# EAGLE design LineFollowTest (EAGLE 9.4.2)

## Sheet 1 of 3
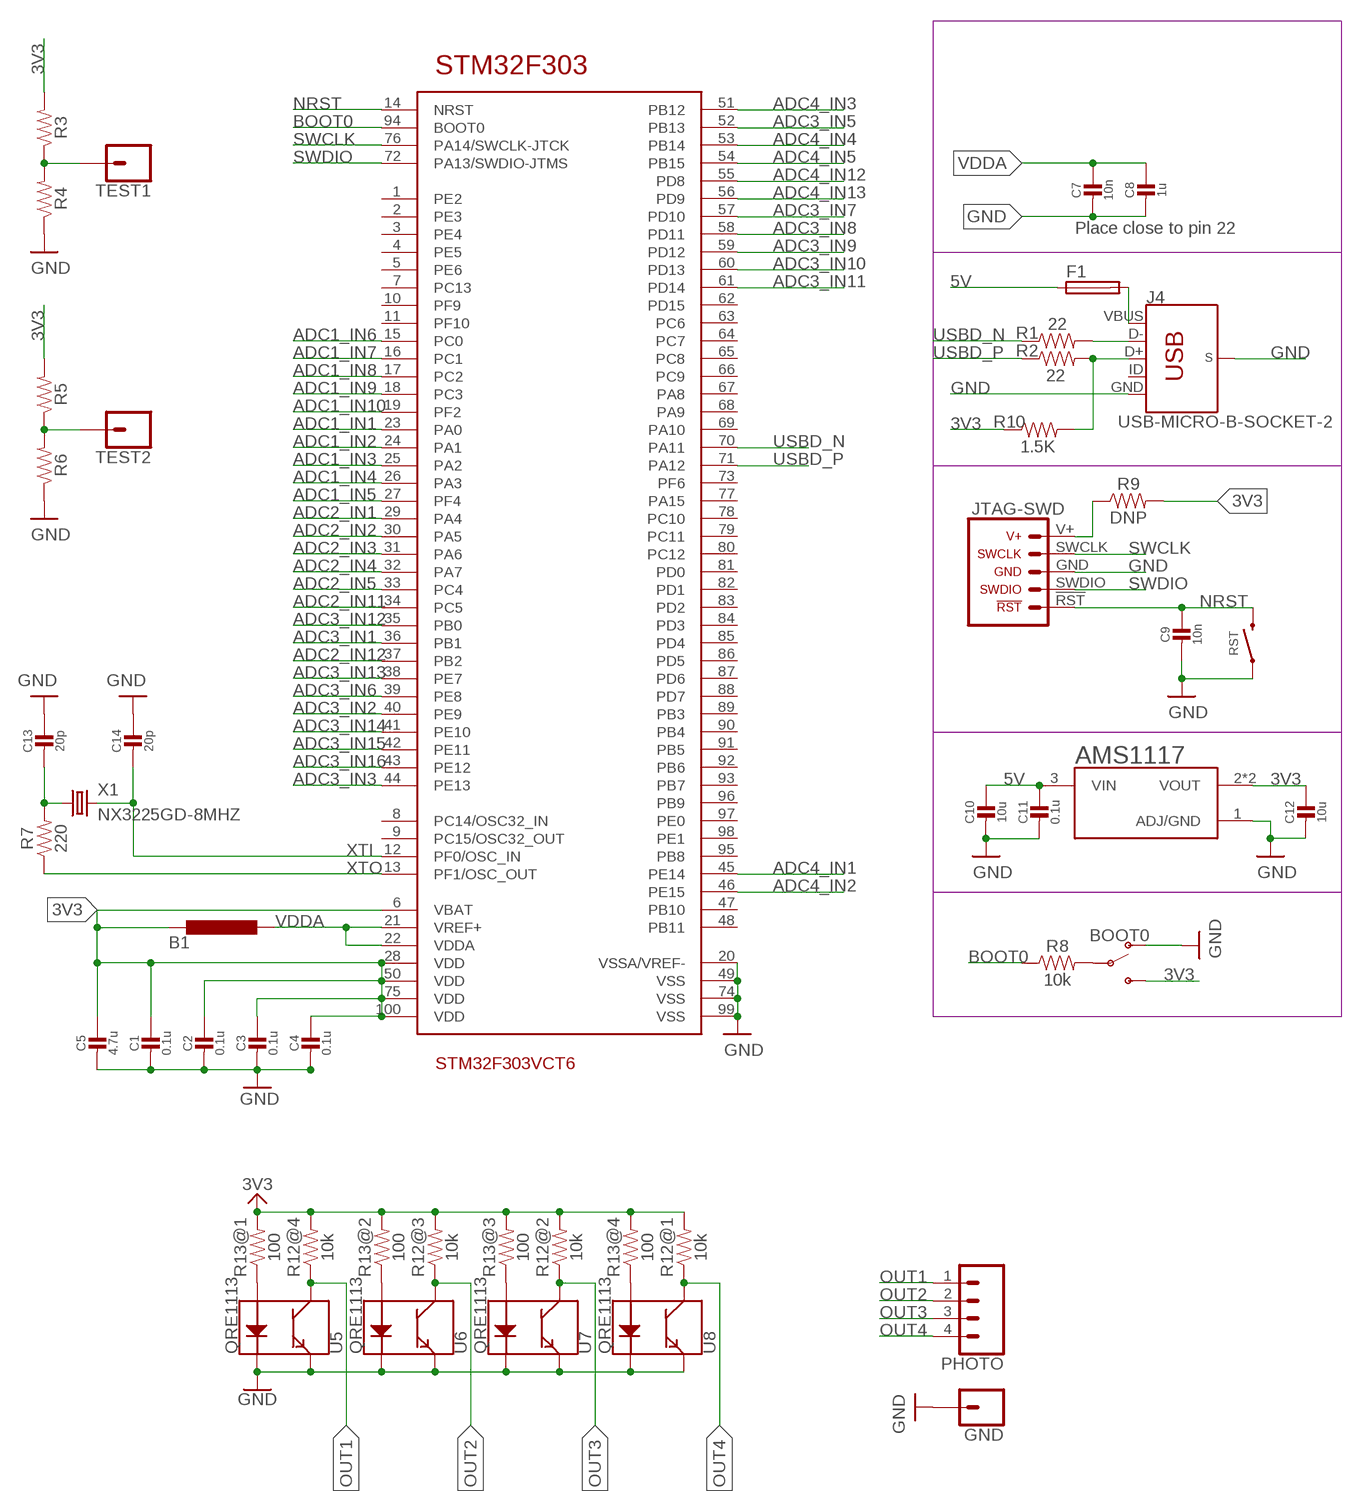
[diagram p0: schematic, sheet 1]

### Parts
AMS1117  3.3V  VREG_AMS1117SMALL  [SOT89]
B1  BEAD-0603  [0603]
BOOT0  SWITCH_SPDT_SLIDE  [SWITCH_SPDT_PTH_11.6X4.0MM]
C1  0.1u  CAP_CERAMIC_0603  [CAP_0603]
C2  0.1u  CAP_CERAMIC_0603  [CAP_0603]
C3  0.1u  CAP_CERAMIC_0603  [CAP_0603]
C4  0.1u  CAP_CERAMIC_0603  [CAP_0603]
C5  4.7u  CAP_CERAMIC_0603  [CAP_0603]
C7  10n  CAP_CERAMIC_0603  [CAP_0603]
C8  1u  CAP_CERAMIC_0603  [CAP_0603]
C9  10n  CAP_CERAMIC_0603  [CAP_0603]
C10  10u  CAP_CERAMIC_0603  [CAP_0603]
C11  0.1u  CAP_CERAMIC_0603  [CAP_0603]
C12  10u  CAP_CERAMIC_0603  [CAP_0603]
C13  20p  CAP_CERAMIC_0603  [CAP_0603]
C14  20p  CAP_CERAMIC_0603  [CAP_0603]
F1  FUSE-1206  [1206]
GND  THD_01  [1X01]
J4  USB-MICRO-B-SOCKET-2  [USB-MICRO-B-SOCKET-2]
PHOTO  CONN_04PTH  [1X04]
R1  22  RESISTOR0603  [0603]
R2  22  RESISTOR0603  [0603]
R3  RESISTOR0603  [0603]
R4  RESISTOR0603  [0603]
R5  RESISTOR0603  [0603]
R6  RESISTOR0603  [0603]
R7  220  RESISTOR0603  [0603]
R8  10k  RESISTOR0603  [0603]
R9  DNP  RESISTOR0603  [0603]
R10  1.5K  RESISTOR0603  [0603]
R12  10k  RESISTOR_ARRAY_1206_SEPARATE  [RESCAF80P320X160X60-8N]
R13  100  RESISTOR_ARRAY_1206_SEPARATE  [RESCAF80P320X160X60-8N]
RST  PUSHBUTTON  [TACTILE_SWITCH_SMD_6.0X3.5MM]
STM32F303  STM32F303VCT6  [LQFP-100]
TEST1  THD_01  [1X01]
TEST2  THD_01  [1X01]
U5  QRE1113  QRE1113SMD-W  [QRE1113-W]
U6  QRE1113  QRE1113SMD-W  [QRE1113-W]
U7  QRE1113  QRE1113SMD-W  [QRE1113-W]
U8  QRE1113  QRE1113SMD-W  [QRE1113-W]
U$3  JTAG-SWD  [JTAG_SWD]
X1  NX3225GD-8MHZ  XTAL-SMD-3225  [XTAL-SMD-3225]

### Nets
3V3: AMS1117.2(VOUT) AMS1117.2@1(VOUT) B1.1 BOOT0.3(S) C1.1 C2.1 C3.1 C4.1 C5.1 C12.1 R3.2 R5.2 R9.2 R10.1 R12.5 R12.6 R12.7 R12.8 R13.5 R13.6 R13.7 R13.8 STM32F303.6(VBAT) STM32F303.28(VDD) STM32F303.50(VDD) STM32F303.75(VDD) STM32F303.100(VDD) ; supply symbol labelled SUPPLY_3.3V
5V: AMS1117.3(VIN) C10.1 C11.1 F1.1
ADC1_IN1: STM32F303.23(PA0) ; also sheet 2
ADC1_IN2: STM32F303.24(PA1) ; also sheet 2
ADC1_IN3: STM32F303.25(PA2) ; also sheet 2
ADC1_IN4: STM32F303.26(PA3) ; also sheet 2
ADC1_IN5: STM32F303.27(PF4) ; also sheet 2
ADC1_IN6: STM32F303.15(PC0) ; also sheet 2
ADC1_IN7: STM32F303.16(PC1) ; also sheet 2
ADC1_IN8: STM32F303.17(PC2) ; also sheet 2
ADC1_IN9: STM32F303.18(PC3) ; also sheet 2
ADC1_IN10: STM32F303.19(PF2) ; also sheet 2
ADC2_IN1: STM32F303.29(PA4) ; also sheet 2
ADC2_IN2: STM32F303.30(PA5) ; also sheet 2
ADC2_IN3: STM32F303.31(PA6) ; also sheet 2
ADC2_IN4: STM32F303.32(PA7) ; also sheet 2
ADC2_IN5: STM32F303.33(PC4) ; also sheet 2
ADC2_IN11: STM32F303.34(PC5) ; also sheet 2
ADC2_IN12: STM32F303.37(PB2) ; also sheet 2
ADC3_IN1: STM32F303.36(PB1) ; also sheet 2
ADC3_IN2: STM32F303.40(PE9) ; also sheet 2
ADC3_IN3: STM32F303.44(PE13) ; also sheet 2
ADC3_IN5: STM32F303.52(PB13) ; also sheet 2
ADC3_IN6: STM32F303.39(PE8) ; also sheet 2
ADC3_IN7: STM32F303.57(PD10) ; also sheet 2
ADC3_IN8: STM32F303.58(PD11) ; also sheet 2
ADC3_IN9: STM32F303.59(PD12) ; also sheet 2
ADC3_IN10: STM32F303.60(PD13) ; also sheet 2
ADC3_IN11: STM32F303.61(PD14) ; also sheet 2
ADC3_IN12: STM32F303.35(PB0) ; also sheet 2
ADC3_IN13: STM32F303.38(PE7) ; also sheet 2
ADC3_IN14: STM32F303.41(PE10) ; also sheet 2
ADC3_IN15: STM32F303.42(PE11) ; also sheet 2
ADC3_IN16: STM32F303.43(PE12) ; also sheet 2
ADC4_IN1: STM32F303.45(PE14) ; also sheet 2
ADC4_IN2: STM32F303.46(PE15) ; also sheet 2
ADC4_IN3: STM32F303.51(PB12) ; also sheet 2
ADC4_IN4: STM32F303.53(PB14) ; also sheet 2
ADC4_IN5: STM32F303.54(PB15) ; also sheet 2
ADC4_IN12: STM32F303.55(PD8) ; also sheet 2
ADC4_IN13: STM32F303.56(PD9) ; also sheet 2
BOOT0: R8.1 STM32F303.94(BOOT0)
GND: AMS1117.1(ADJ/GND) BOOT0.1(O) C1.2 C2.2 C3.2 C4.2 C5.2 C7.2 C8.2 C9.2 C10.2 C11.2 C12.2 C13.1 C14.1 GND.1 J4.GND J4.S1(SHIELD) J4.S2(SHIELD) J4.S3(SHIELD) J4.S4(SHIELD) J4.S5(SHIELD) R4.1 R6.1 RST.1 STM32F303.20(VSSA/VREF-) STM32F303.49(VSS) STM32F303.74(VSS) STM32F303.99(VSS) U5.2(K) U5.4(E) U6.2(K) U6.4(E) U7.2(K) U7.4(E) U8.2(K) U8.4(E) U$3.GND ; supply symbol labelled SUPPLY_GND
N$1: R5.1 R6.2 TEST2.1
N$2: C13.2 R7.2 X1.1
N$3: BOOT0.2(P) R8.2
N$4: R9.1 U$3.V+
N$9: R3.1 R4.2 TEST1.1
N$10: F1.2 J4.VBUS
N$11: J4.D- R1.2
N$12: J4.D+ R2.2 R10.2
N$13: R13.1 U5.1(A)
N$14: R13.2 U6.1(A)
N$15: R13.3 U7.1(A)
N$16: R13.4 U8.1(A)
NRST: C9.1 RST.2 STM32F303.14(NRST) U$3.!RST
OUT1: PHOTO.1 R12.4 U5.3(C)
OUT2: PHOTO.2 R12.3 U6.3(C)
OUT3: PHOTO.3 R12.2 U7.3(C)
OUT4: PHOTO.4 R12.1 U8.3(C)
SWCLK: STM32F303.76(PA14/SWCLK-JTCK) U$3.SWCLK
SWDIO: STM32F303.72(PA13/SWDIO-JTMS) U$3.SWDIO
USBD_N: R1.1 STM32F303.70(PA11)
USBD_P: R2.1 STM32F303.71(PA12)
VDDA: B1.2 C7.1 C8.1 STM32F303.21(VREF+) STM32F303.22(VDDA)
XTI: C14.2 STM32F303.12(PF0/OSC_IN) X1.2
XTO: R7.1 STM32F303.13(PF1/OSC_OUT)
Unconnected: J4.ID STM32F303.1(PE2) STM32F303.2(PE3) STM32F303.3(PE4) STM32F303.4(PE5) STM32F303.5(PE6) STM32F303.7(PC13) STM32F303.8(PC14/OSC32_IN) STM32F303.9(PC15/OSC32_OUT) STM32F303.10(PF9) STM32F303.11(PF10) STM32F303.47(PB10) STM32F303.48(PB11) STM32F303.62(PD15) STM32F303.63(PC6) STM32F303.64(PC7) STM32F303.65(PC8) STM32F303.66(PC9) STM32F303.67(PA8) STM32F303.68(PA9) STM32F303.69(PA10) STM32F303.73(PF6) STM32F303.77(PA15) STM32F303.78(PC10) STM32F303.79(PC11) STM32F303.80(PC12) STM32F303.81(PD0) STM32F303.82(PD1) STM32F303.83(PD2) STM32F303.84(PD3) STM32F303.85(PD4) STM32F303.86(PD5) STM32F303.87(PD6) STM32F303.88(PD7) STM32F303.89(PB3) STM32F303.90(PB4) STM32F303.91(PB5) STM32F303.92(PB6) STM32F303.93(PB7) STM32F303.95(PB8) STM32F303.96(PB9) STM32F303.97(PE0) STM32F303.98(PE1)

### Notes on the sheet
- Place close to pin 22

## Sheet 2 of 3
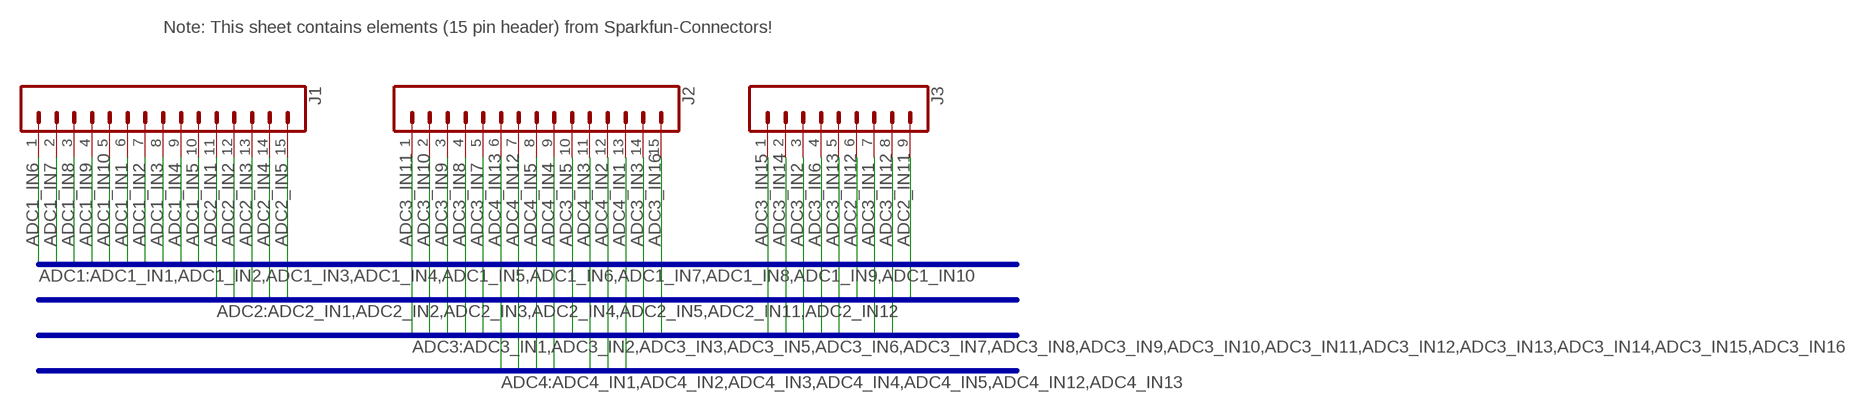
[diagram p1: schematic, sheet 2]

### Parts
J1  CONN_15  [1X15]
J2  CONN_15  [1X15]
J3  CONN_09  [1X09]

### Nets
ADC1_IN1: J1.6 ; also sheet 1
ADC1_IN2: J1.7 ; also sheet 1
ADC1_IN3: J1.8 ; also sheet 1
ADC1_IN4: J1.9 ; also sheet 1
ADC1_IN5: J1.10 ; also sheet 1
ADC1_IN6: J1.1 ; also sheet 1
ADC1_IN7: J1.2 ; also sheet 1
ADC1_IN8: J1.3 ; also sheet 1
ADC1_IN9: J1.4 ; also sheet 1
ADC1_IN10: J1.5 ; also sheet 1
ADC2_IN1: J1.11 ; also sheet 1
ADC2_IN2: J1.12 ; also sheet 1
ADC2_IN3: J1.13 ; also sheet 1
ADC2_IN4: J1.14 ; also sheet 1
ADC2_IN5: J1.15 ; also sheet 1
ADC2_IN11: J3.9 ; also sheet 1
ADC2_IN12: J3.6 ; also sheet 1
ADC3_IN1: J3.7 ; also sheet 1
ADC3_IN2: J3.3 ; also sheet 1
ADC3_IN3: J2.14 ; also sheet 1
ADC3_IN5: J2.10 ; also sheet 1
ADC3_IN6: J3.4 ; also sheet 1
ADC3_IN7: J2.5 ; also sheet 1
ADC3_IN8: J2.4 ; also sheet 1
ADC3_IN9: J2.3 ; also sheet 1
ADC3_IN10: J2.2 ; also sheet 1
ADC3_IN11: J2.1 ; also sheet 1
ADC3_IN12: J3.8 ; also sheet 1
ADC3_IN13: J3.5 ; also sheet 1
ADC3_IN14: J3.2 ; also sheet 1
ADC3_IN15: J3.1 ; also sheet 1
ADC3_IN16: J2.15 ; also sheet 1
ADC4_IN1: J2.13 ; also sheet 1
ADC4_IN2: J2.12 ; also sheet 1
ADC4_IN3: J2.11 ; also sheet 1
ADC4_IN4: J2.9 ; also sheet 1
ADC4_IN5: J2.8 ; also sheet 1
ADC4_IN12: J2.7 ; also sheet 1
ADC4_IN13: J2.6 ; also sheet 1

### Buses
ADC1:ADC1_IN1,ADC1_IN2,ADC1_IN3,ADC1_IN4,ADC1_IN5,ADC1_IN6,ADC1_IN7,ADC1_IN8,ADC1_IN9,ADC1_IN10
ADC2:ADC2_IN1,ADC2_IN2,ADC2_IN3,ADC2_IN4,ADC2_IN5,ADC2_IN11,ADC2_IN12
ADC3:ADC3_IN1,ADC3_IN2,ADC3_IN3,ADC3_IN5,ADC3_IN6,ADC3_IN7,ADC3_IN8,ADC3_IN9,ADC3_IN10,ADC3_IN11,ADC3_IN12,ADC3_IN13,ADC3_IN14,ADC3_IN15,ADC3_IN16
ADC4:ADC4_IN1,ADC4_IN2,ADC4_IN3,ADC4_IN4,ADC4_IN5,ADC4_IN12,ADC4_IN13

### Notes on the sheet
- Note: This sheet contains elements (15 pin header) from Sparkfun-Connectors!

## Sheet 3 of 3
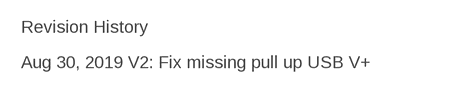
[diagram p2: schematic, sheet 3]

### Notes on the sheet
- Revision History
- Aug 30, 2019 V2: Fix missing pull up USB V+

## Library data of the parts
AMS1117 = Scott-ICs:VREG_AMS1117: 1-Amp Low Drop Out Voltage Regulatator
B1 = Scott-Electrical:BEAD
BOOT0 = Scott-Switches:SWITCH_SPDT_SLIDE: 拨动开关SK12D07VG2/3/4/5/6 侧面5脚拨动带支架 3脚2档柄高6MM Taobao <https://item.taobao.com/item.htm?spm=a1z09.2.0.0.53a62e8d0RVocC&id=563254128682&_u=s1po4ce26496> Dimensional Drawing <https://img.alicdn.com/imgextra/i1/2744920356/TB2568GkMDD8KJjy0FdXXcjvXXa_!!2744920356.jpg>
C1-C5 C7-C14 = Scott-Electrical:CAP_CERAMIC
F1 = Scott-Electrical:FUSE
GND TEST1 TEST2 = Scott-Connectors:THD_01
J1 J2 = SparkFun-Connectors:CONN_15: Multi connection point. Often used as Generic Header-pin footprint for 0.1 inch spaced/style header connections On any of the 0.1 inch spaced packages, you can populate with these: Break Away Headers - Straight <https://www.sparkfun.com/products/116> (PRT-00116) Break Away Male Headers - Right Angle <https://www.sparkfun.com/products/553> (PRT-00553) Female Headers <https://www.sparkfun.com/products/115> (PRT-00115) Break Away Headers - Machine Pin <https://www.sparkfun.com/products/117> (PRT-00117) Break Away Female Headers - Swiss Machine Pin <https://www.sparkfun.com/products/743> (PRT-00743) For SCREWTERMINALS and SPRING TERMINALS visit here: Screw Terimnals on SparkFun.com <https://www.sparkfun.com/search/results?term=Screw+Terminals> (5mm/3.5mm/2.54mm spacing) This device is also useful as a general connection point to wire up your design to another part of your project. Our various solder wires solder well into these plated through hole pads. Hook-Up Wire - Assortment (Stranded, 22 AWG) <https://www.sparkfun.com/products/11375> (PRT-11375) Hook-Up Wire - Assortment (Solid Core, 22 AWG) <https://www.sparkfun.com/products/11367> (PRT-11367) View the entire wire category on our website here <https://www.sparkfun.com/categories/141> Special notes: Molex polarized connector foot print use with SKU : PRT-08231 with associated crimp pins and housings. 1MM SMD Version SKU: PRT-10208 NOTES ON THE VARIANTS LOCK and LOCK_LONGPADS... This footprint was designed to help hold the alignment of a through-hole component (i.e. 6-pin header) while soldering it into place. You may notice that each hole has been shifted either up or down by 0.005 of an inch from it's more standard position (which is a perfectly straight line). This slight alteration caused the pins (the squares in the middle) to touch the edges of the holes. Because they are alternating, it causes a "brace" to hold the component in place. 0.005 has proven to be the perfect amount of "off-center" position when using our standard breakaway headers. Although looks a little odd when you look at the bare footprint, once you have a header in there, the alteration is very hard to notice. Also,if you push a header all the way into place, it is covered up entirely on the bottom side.
J3 = SparkFun-Connectors:CONN_09: Multi connection point. Often used as Generic Header-pin footprint for 0.1 inch spaced/style header connections On any of the 0.1 inch spaced packages, you can populate with these: Break Away Headers - Straight <https://www.sparkfun.com/products/116> (PRT-00116) Break Away Male Headers - Right Angle <https://www.sparkfun.com/products/553> (PRT-00553) Female Headers <https://www.sparkfun.com/products/115> (PRT-00115) Break Away Headers - Machine Pin <https://www.sparkfun.com/products/117> (PRT-00117) Break Away Female Headers - Swiss Machine Pin <https://www.sparkfun.com/products/743> (PRT-00743) For SCREWTERMINALS and SPRING TERMINALS visit here: Screw Terimnals on SparkFun.com <https://www.sparkfun.com/search/results?term=Screw+Terminals> (5mm/3.5mm/2.54mm spacing) This device is also useful as a general connection point to wire up your design to another part of your project. Our various solder wires solder well into these plated through hole pads. Hook-Up Wire - Assortment (Stranded, 22 AWG) <https://www.sparkfun.com/products/11375> (PRT-11375) Hook-Up Wire - Assortment (Solid Core, 22 AWG) <https://www.sparkfun.com/products/11367> (PRT-11367) View the entire wire category on our website here <https://www.sparkfun.com/categories/141> Special notes: Molex polarized connector foot print use with SKU : PRT-08231 with associated crimp pins and housings. 1MM SMD Version SKU: PRT-10208 NOTES ON THE VARIANTS LOCK and LOCK_LONGPADS... This footprint was designed to help hold the alignment of a through-hole component (i.e. 6-pin header) while soldering it into place. You may notice that each hole has been shifted either up or down by 0.005 of an inch from it's more standard position (which is a perfectly straight line). This slight alteration caused the pins (the squares in the middle) to touch the edges of the holes. Because they are alternating, it causes a "brace" to hold the component in place. 0.005 has proven to be the perfect amount of "off-center" position when using our standard breakaway headers. Although looks a little odd when you look at the bare footprint, once you have a header in there, the alteration is very hard to notice. Also,if you push a header all the way into place, it is covered up entirely on the bottom side.
J4 = Scott-Connectors:USB-MICRO-B-SOCKET-
PHOTO = SparkFun-Connectors:CONN_04: Multi connection point. Often used as Generic Header-pin footprint for 0.1 inch spaced/style header connections On any of the 0.1 inch spaced packages, you can populate with these: Break Away Headers - Straight <https://www.sparkfun.com/products/116> (PRT-00116) Break Away Male Headers - Right Angle <https://www.sparkfun.com/products/553> (PRT-00553) Female Headers <https://www.sparkfun.com/products/115> (PRT-00115) Break Away Headers - Machine Pin <https://www.sparkfun.com/products/117> (PRT-00117) Break Away Female Headers - Swiss Machine Pin <https://www.sparkfun.com/products/743> (PRT-00743) For SCREWTERMINALS and SPRING TERMINALS visit here: Screw Terimnals on SparkFun.com <https://www.sparkfun.com/search/results?term=Screw+Terminals> (5mm/3.5mm/2.54mm spacing) This device is also useful as a general connection point to wire up your design to another part of your project. Our various solder wires solder well into these plated through hole pads. Hook-Up Wire - Assortment (Stranded, 22 AWG) <https://www.sparkfun.com/products/11375> (PRT-11375) Hook-Up Wire - Assortment (Solid Core, 22 AWG) <https://www.sparkfun.com/products/11367> (PRT-11367) View the entire wire category on our website here <https://www.sparkfun.com/categories/141> Special notes: Molex polarized connector foot print use with SKU : PRT-08231 with associated crimp pins and housings. 1MM SMD Version SKU: PRT-10208; PROD_ID: CONN-09696
R1-R10 = Scott-Electrical:RESISTOR: Generic Resistor Package
R12 R13 = Scott-Electrical:RESISTOR_ARRAY_1206_SEPARATE
RST = Scott-Switches:PUSHBUTTON
STM32F303 = Scott-MCU:STM32F303VCT6
U5-U8 = Scott-Sensors:QRE1113: QRE1113 Reflective Object Sensor The QRE1113 is a small IR reflectance sensor. This sensor is often used in line following robots because, if it can sense if a surface is white or black. There are four pins on the QRE1113 - two control the IR emitting LED while the other two are the collector and emitter of a phototransistor. The IR diode has a max forward current of 50mA and operates at 940nm. Datasheet <http://www.sparkfun.com/datasheets/Components/SMD/QRE1113.GR.pdf> SparkFun Products IR Reflectance Sensor - QRE1113 <https://www.sparkfun.com/products/9542> (COM-09542) SparkFun Line Sensor Breakout - QRE1113 (Analog) <https://www.sparkfun.com/products/9453> (ROB-09453) SparkFun Line Sensor Breakout - QRE1113 (Digital) <https://www.sparkfun.com/products/9454> (ROB-09454) SparkFun RedBot Sensor - Line Follower <https://www.sparkfun.com/products/11769> (SEN-11769) SparkFun RedBot Sensor - Wheel Encoder <https://www.sparkfun.com/products/12617> (SEN-12617) SparkFun Line Follower Array <https://www.sparkfun.com/products/13582> (SEN-13582); PROD_ID: IC-09357; SF_ID: COM-09542
U$3 = Scott-Connectors:JTAG-SWD
X1 = Scott-ICs:XTAL

## Board
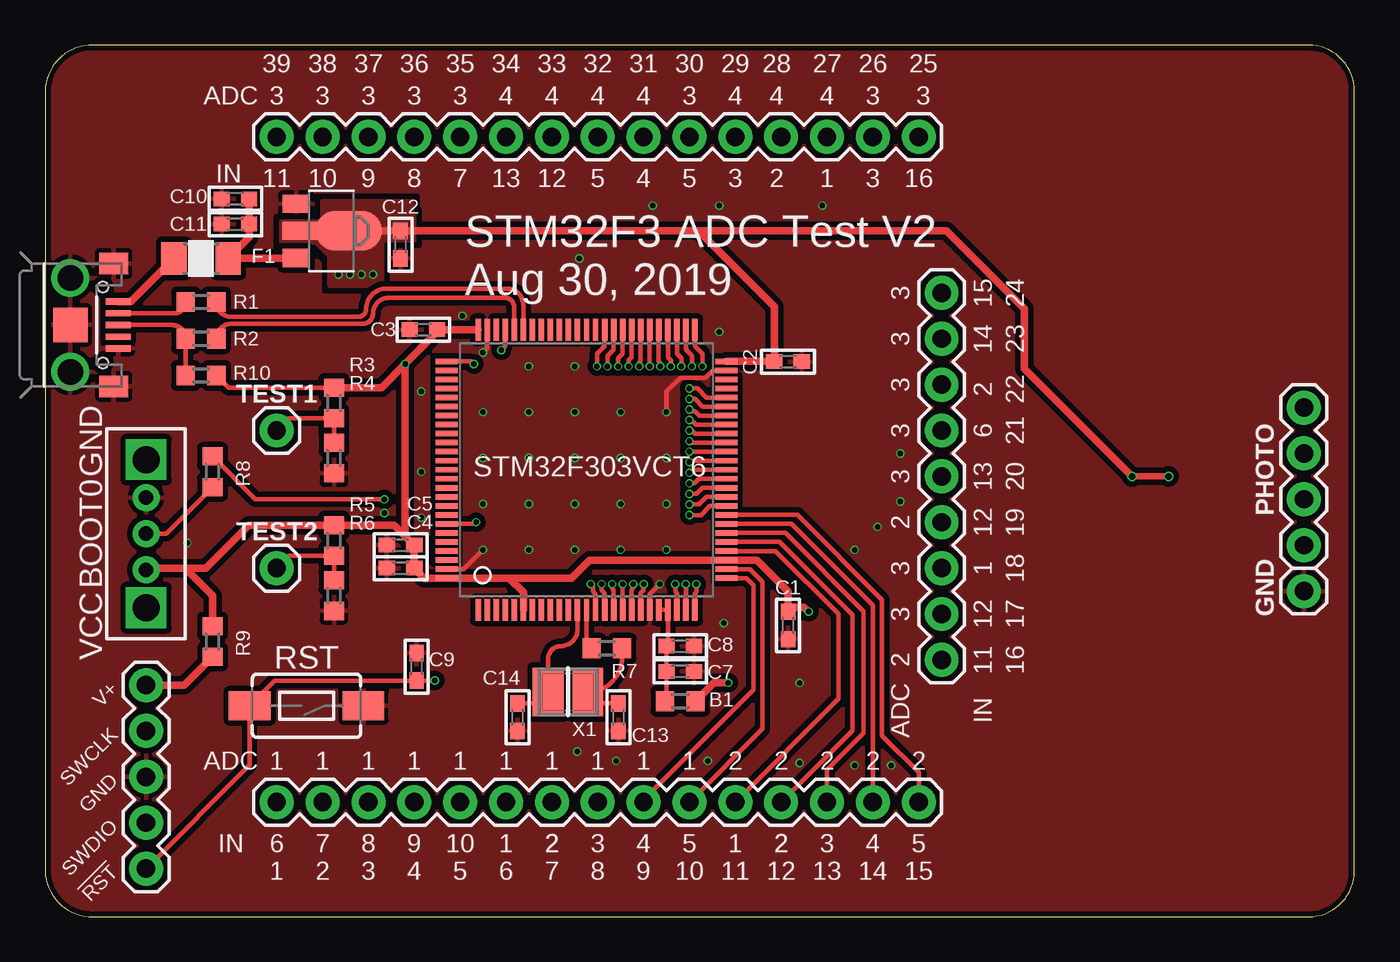
[diagram p3: board, top side]
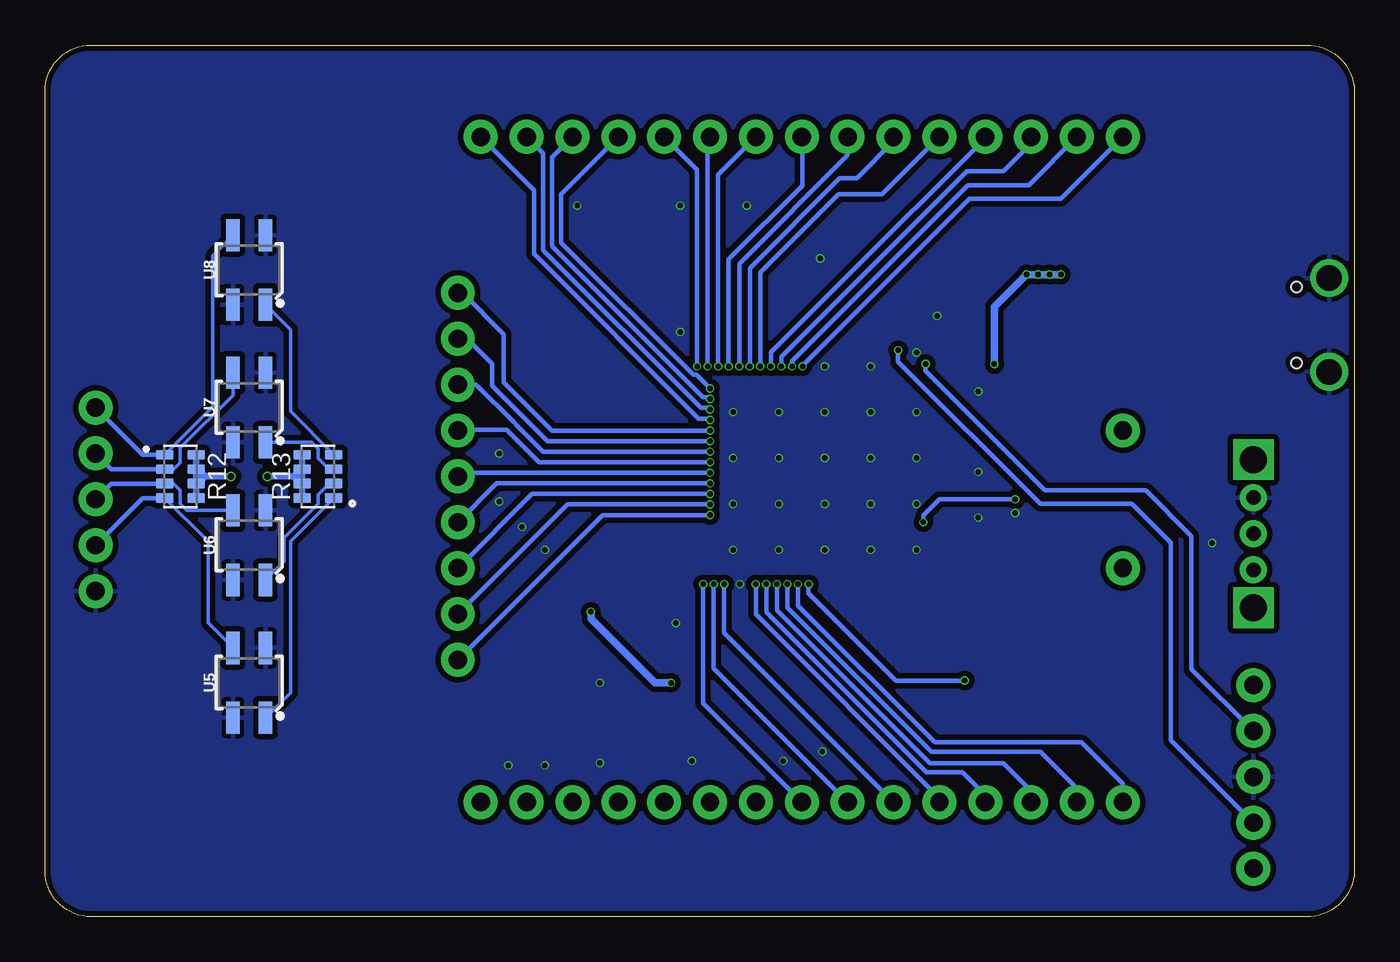
[diagram p4: board, bottom side, seen from below]

Size 72.52 x 48.26 mm. Coordinates in mm from the lower left corner, seen from the top.
Outline: 0,45.72 0,2.54 arc90 2.67,0 69.98,0 arc90 72.52,2.54 72.52,45.72 arc90 69.98,48.26 2.67,48.26 arc90 0,45.72
Copper layers (1*16): Top 0.035559375mm / dielectric 1.6mm / Bottom 0.035559375mm
Design rules "jlcpcb2layer": minimum track width 5mil, minimum drill 12mil, track to track 5mil, track to pad 5mil, pad to pad 5mil, via to via 5mil, smd to smd 5mil, copper to edge 8mil, drill to drill 6mil, minimum pad ring 5mil, minimum via ring 3mil, stop-mask expansion 2.5mil, vias tented up to drill 20mil, thermal gap 10mil

### Footprints (pad centres in the part's own frame; a part is rotated, then mirrored left to right if it is on the bottom)
SOT89 = smd 1 x 1.5: 1 -1.499,-1.981; 3 1.499,-1.981 | smd 1 x 2: 2 0,-1.727 | smd 2.2 x 3.7: 2@1 0,0.94
0603 = smd 1 x 1.1: 1 -0.85,0; 2 0.85,0
SWITCH_SPDT_PTH_11.6X4.0MM = drill 0.8 pad 1.5: 1 0,2; 2 0,0; 3 0,-2 | drill 1.5 pad 1.8 square: P$1 0,-4.1; P$2 0,4.1
CAP_0603 = smd 0.9 x 0.8: 1 -0.762,0; 2 0.762,0
1206 = smd 1.4 x 1.803: 1 -1.5,0; 2 1.5,0
1X01 = drill 1.016 pad 1.88: 1 0,0
1X15 = drill 1.016 pad 1.88: 1 0,0; 2 2.54,0; 3 5.08,0; 4 7.62,0; 5 10.16,0; 6 12.7,0; 7 15.24,0; 8 17.78,0; 9 20.32,0; 10 22.86,0; 11 25.4,0; 12 27.94,0; 13 30.48,0; 14 33.02,0; 15 35.56,0
1X09 = drill 1.016 pad 1.88: 1 0,0; 2 2.54,0; 3 5.08,0; 4 7.62,0; 5 10.16,0; 6 12.7,0; 7 15.24,0; 8 17.78,0; 9 20.32,0
USB-MICRO-B-SOCKET-2 = smd 1.4 x 0.35: D+ -2.65,0; D- -2.65,-0.65; GND -2.65,1.3; ID -2.65,0.65; VBUS -2.65,-1.3 | drill 1.4: S1 0,2.6; S2 0,-2.6 | smd 1.9 x 1.9: S3 0,0 | smd 1.6 x 1.2: S4 -2.4,3.4; S5 -2.4,-3.4 | hole 0.6: -1.8,2.1; -1.8,-2.1
1X04 = drill 1.016 pad 1.88: 1 0,0; 2 2.54,0; 3 5.08,0; 4 7.62,0
RESCAF80P320X160X60-8N = smd 0.97 x 0.53: 1 -0.875,1.2; 2 -0.875,0.4; 3 -0.875,-0.4; 4 -0.875,-1.2; 5 0.875,-1.2; 6 0.875,-0.4; 7 0.875,0.4; 8 0.875,1.2
TACTILE_SWITCH_SMD_6.0X3.5MM = smd 2.3 x 1.6: 1 -3.15,0; 2 3.15,0
LQFP-100 = smd 0.3 x 1.2: 1 1,-14.75; 2 1.5,-14.75; 3 2,-14.75; 4 2.5,-14.75; 5 3,-14.75; 6 3.5,-14.75; 7 4,-14.75; 8 4.5,-14.75; 9 5,-14.75; 10 5.5,-14.75; 11 6,-14.75; 12 6.5,-14.75; 13 7,-14.75; 14 7.5,-14.75; 15 8,-14.75; 16 8.5,-14.75; 17 9,-14.75; 18 9.5,-14.75; 19 10,-14.75; 20 10.5,-14.75; 21 11,-14.75; 22 11.5,-14.75; 23 12,-14.75; 24 12.5,-14.75; 25 13,-14.75; 51 13,0.75; 52 12.5,0.75; 53 12,0.75; 54 11.5,0.75; 55 11,0.75; 56 10.5,0.75; 57 10,0.75; 58 9.5,0.75; 59 9,0.75; 60 8.5,0.75; 61 8,0.75; 62 7.5,0.75; 63 7,0.75; 64 6.5,0.75; 65 6,0.75; 66 5.5,0.75; 67 5,0.75; 68 4.5,0.75; 69 4,0.75; 70 3.5,0.75; 71 3,0.75; 72 2.5,0.75; 73 2,0.75; 74 1.5,0.75; 75 1,0.75 | smd 1.2 x 0.3: 26 14.75,-13; 27 14.75,-12.5; 28 14.75,-12; 29 14.75,-11.5; 30 14.75,-11; 31 14.75,-10.5; 32 14.75,-10; 33 14.75,-9.5; 34 14.75,-9; 35 14.75,-8.5; 36 14.75,-8; 37 14.75,-7.5; 38 14.75,-7; 39 14.75,-6.5; 40 14.75,-6; 41 14.75,-5.5; 42 14.75,-5; 43 14.75,-4.5; 44 14.75,-4; 45 14.75,-3.5; 46 14.75,-3; 47 14.75,-2.5; 48 14.75,-2; 49 14.75,-1.5; 50 14.75,-1; 76 -0.75,-1; 77 -0.75,-1.5; 78 -0.75,-2; 79 -0.75,-2.5; 80 -0.75,-3; 81 -0.75,-3.5; 82 -0.75,-4; 83 -0.75,-4.5; 84 -0.75,-5; 85 -0.75,-5.5; 86 -0.75,-6; 87 -0.75,-6.5; 88 -0.75,-7; 89 -0.75,-7.5; 90 -0.75,-8; 91 -0.75,-8.5; 92 -0.75,-9; 93 -0.75,-9.5; 94 -0.75,-10; 95 -0.75,-10.5; 96 -0.75,-11; 97 -0.75,-11.5; 98 -0.75,-12; 99 -0.75,-12.5; 100 -0.75,-13
QRE1113-W = smd 1.778 x 0.762: 1 -1.927,-0.9; 2 1.927,-0.9; 3 1.927,0.9; 4 -1.927,0.9
JTAG_SWD = drill 1.016 pad 1.88: !RST 0,-10.16; GND 0,-5.08; SWCLK 0,-2.54; SWDIO 0,-7.62; V+ 0,0
XTAL-SMD-3225 = smd 1.7 x 2.7: 1 -1.1,0; 2 1.1,0

### Placement (x,y rotation side)
AMS1117  15.88,37.97 270 top
B1  35.18,11.94 180 top
BOOT0  5.59,21.21 0 top
C1  41.15,16.13 270 top
C2  41.15,30.73 0 top
C3  20.95,32.51 180 top
C4  19.69,19.3 180 top
C5  19.69,20.57 180 top
C7  35.18,13.59 0 top
C8  35.18,14.99 0 top
C9  20.57,13.84 90 top
C10  10.54,39.75 180 top
C11  10.54,38.35 180 top
C12  19.69,37.21 270 top
C13  31.75,11.05 90 top
C14  26.16,11.05 90 top
F1  8.64,36.45 180 top
GND  69.72,18.03 90 top
J1  12.83,6.35 0 top
J2  12.83,43.18 0 top
J3  49.66,34.54 270 top
J4  1.4,32.77 180 top
PHOTO  69.72,20.57 90 top
R1  8.64,34.04 180 top
R2  8.64,32 180 top
R3  16,28.45 90 top
R4  16,25.4 90 top
R5  16,20.83 90 top
R6  16,17.78 90 top
R7  31.12,14.86 0 top
R8  9.27,24.64 270 top
R9  9.27,15.24 90 top
R10  8.64,29.97 180 top
R12  65.02,24.38 0 bottom
R13  57.4,24.38 180 bottom
RST  14.48,11.68 180 top
STM32F303  22.99,31.75 0 top
TEST1  12.83,26.92 0 top
TEST2  12.83,19.3 0 top
U5  61.21,12.95 90 bottom
U6  61.21,20.57 90 bottom
U7  61.21,28.19 90 bottom
U8  61.21,35.81 90 bottom
U$3  5.59,12.83 0 top
X1  28.96,12.45 180 top

### Tracks (layer width: path | path; a pad name or v marks a point on that pad's centre or on a via)
3V3  (via drill 0.3, 0.35)
  Top 0.254: 40.37,30.75 C2.1 | STM32F303.75 23.98,32.51 | 41.4,17.14 C1.1 | R10.1 10.16,29.3 R3.2
  Top 0.356: v62.23,24.38 v60.2,24.38
  Top 0.406: AMS1117.2@1 C12.1 36.2,37.97 | C1.1 41.15,18.03 39.43,19.75 STM32F303.28 30.16,19.75 29.16,18.75 25.7,18.75 | STM32F303.50 40.37,30.75 | 23.98,32.51 C3.1 21.72,32.38 v19.94,30.61 | v19.94,30.61 19.94,21.08 | 19.94,21.08 C5.1 C4.1 21,18.75 STM32F303.100 25.7,18.75 | R9.2 9.27,17.78 7.75,19.3 | 7.75,19.3 5.68,19.3 BOOT0.3 | 19.94,21.08 19.34,21.68 R5.2 11.26,21.68 8.89,19.3 7.75,19.3 | R3.2 18.63,29.3 v19.94,30.61 | STM32F303.6 26.49,17.96 25.7,18.75 | B1.1 37.05,12.95 v37.85,12.95 | v42.29,16.89 42.04,17.14 41.4,17.14 | 36.2,37.97 40.39,33.78 C2.1 | v60.2,24.38 54.23,30.35 54.23,33.67 49.93,37.97 36.2,37.97
  Bottom 0.152: R12.6 63.9,23.98 63.5,24.38 63.9,24.78 R12.7 | R13.7 58.53,23.98 58.93,24.38 58.53,24.78 R13.6
  Bottom 0.356: R12.5 R12.6 64.15,24.38 | 64.15,24.38 R12.7 R12.8 | R13.5 R13.6 58.28,24.38 | 58.28,24.38 R13.7 R13.8 | 58.28,24.38 58.93,24.38 v60.2,24.38 | 64.15,24.38 63.5,24.38 v62.23,24.38
  Bottom 0.406: v16.26,35.56 v16.89,35.56 v17.53,35.56 v18.16,35.56 19.94,33.78 v19.94,30.61 | v37.85,12.95 38.73,12.95 42.29,16.51 v42.29,16.89
  pour Top (isolate 0.305, no thermals): 13.08,37.34 14.99,37.34 15.75,36.58 15.75,34.92 18.67,34.92 18.67,37.47 20.45,37.47 20.45,38.86 20.32,38.99 20.32,39.62 15.37,39.62 15.37,38.48 13.08,38.48
5V
  Top 0.406: AMS1117.3 10.16,36.47 F1.1 11.3,37.62 C11.1 C10.1
ADC1_IN1  (via drill 0.3)
  Top 0.254: STM32F303.23 34.99,17.91 34.9,17.99 v34.9,18.41
  Bottom 0.254: J1.6 34.9,15.73 v34.9,18.41
ADC1_IN2  (via drill 0.3)
  Top 0.254: STM32F303.24 v35.49,18.41
  Bottom 0.254: J1.7 35.49,13.77 v35.49,18.41
ADC1_IN3  (via drill 0.3)
  Top 0.254: STM32F303.25 35.99,17.91 36.07,17.99 v36.07,18.41
  Bottom 0.254: J1.8 36.07,11.81 v36.07,18.41
ADC1_IN4
  Top 0.254: STM32F303.26 38.84,18.75 39.24,18.35 39.24,12.57 33.15,6.48 J1.9
ADC1_IN5
  Top 0.254: STM32F303.27 39.05,19.25 39.74,18.56 39.74,10.41 J1.10
ADC1_IN6  (via drill 0.3)
  Top 0.254: STM32F303.15 30.99,17.91 30.82,18.07 v30.82,18.41
  Bottom 0.254: v30.82,18.41 30.82,17.23 23.24,9.65 15.11,9.65 12.83,7.37 J1.1
ADC1_IN7  (via drill 0.3)
  Top 0.254: STM32F303.16 31.49,18.11 31.4,18.2 v31.4,18.41
  Bottom 0.254: v31.4,18.41 31.4,17.11 23.44,9.14 17.4,9.14 15.37,7.11 J1.2
ADC1_IN8  (via drill 0.3)
  Top 0.254: STM32F303.17 v31.99,18.41
  Bottom 0.254: v31.99,18.41 31.99,16.98 23.51,8.51 19.43,8.51 17.91,6.98 J1.3
ADC1_IN9  (via drill 0.3)
  Top 0.254: STM32F303.18 32.49,18.11 32.57,18.2 v32.57,18.41
  Bottom 0.254: v32.57,18.41 32.57,16.86 23.71,8 21.72,8 20.45,6.73 J1.4
ADC1_IN10  (via drill 0.3)
  Top 0.254: STM32F303.19 32.99,17.91 33.16,18.07 v33.16,18.41
  Bottom 0.254: v33.16,18.41 33.16,16.74 22.99,6.57 J1.5
ADC2_IN1
  Top 0.254: STM32F303.29 40.46,20.25 43.94,16.76 43.94,12.06 J1.11
ADC2_IN2
  Top 0.254: STM32F303.30 40.66,20.75 44.7,16.71 44.7,10.29 J1.12
ADC2_IN3
  Top 0.254: STM32F303.31 41,21.25 45.34,16.91 45.34,10.16 43.31,8.13 J1.13
ADC2_IN4
  Top 0.254: STM32F303.32 41.33,21.75 45.85,17.23 J1.14
ADC2_IN5
  Top 0.254: STM32F303.33 41.66,22.25 46.36,17.56 46.36,10.03 48.39,8 J1.15
ADC2_IN11  (via drill 0.3)
  Top 0.254: STM32F303.34 36.83,22.75 36.33,22.24 v35.69,22.24
  Bottom 0.254: J3.9 41.64,22.24 v35.69,22.24
ADC2_IN12  (via drill 0.3)
  Top 0.254: STM32F303.37 36.21,24.25 35.96,24 v35.69,24
  Bottom 0.254: J3.6 47.5,24 v35.69,24
ADC3_IN1  (via drill 0.3)
  Top 0.254: STM32F303.36 36.42,23.75 36.08,23.41 v35.69,23.41
  Bottom 0.254: J3.7 45.55,23.41 v35.69,23.41
ADC3_IN2  (via drill 0.3)
  Top 0.254: STM32F303.40 v35.69,25.75
  Bottom 0.254: v35.69,25.75 44.93,25.75 46.42,27.24 46.55,27.37 48.64,29.46 J3.3
ADC3_IN3  (via drill 0.3)
  Top 0.254: STM32F303.44 36.25,27.75 36,28 35.77,28 v35.69,28.09
  Bottom 0.254: v35.69,28.09 35.77,28.17 36.2,28.17 44.94,36.92 44.94,42.27 J2.14
ADC3_IN5  (via drill 0.3)
  Top 0.254: STM32F303.52 35.49,31.39 35.82,31.05 v35.82,30.48
  Bottom 0.254: J2.10 35.82,43.04 v35.82,30.48
ADC3_IN6  (via drill 0.3)
  Top 0.254: STM32F303.39 35.8,25.25 35.71,25.17 v35.69,25.17
  Bottom 0.254: v35.69,25.17 45.17,25.17 46.96,26.95 49.63,26.95 J3.4
ADC3_IN7  (via drill 0.3)
  Top 0.254: STM32F303.57 32.99,30.77 32.9,30.68 v32.9,30.48
  Bottom 0.254: v32.9,30.48 32.9,35.68 28.58,40 26.16,40 J2.5
ADC3_IN8  (via drill 0.3)
  Top 0.254: STM32F303.58 32.49,30.97 32.32,30.8 v32.32,30.48
  Bottom 0.254: v32.32,30.48 32.32,31.25 24.42,39.15 24.35,39.21 20.45,43.12 J2.4
ADC3_IN9  (via drill 0.3)
  Top 0.254: STM32F303.59 31.99,31.18 31.73,30.93 v31.73,30.48
  Bottom 0.254: v31.73,30.48 31.73,31 21.46,41.27 19.43,41.27 17.91,42.8 J2.3
ADC3_IN10  (via drill 0.3)
  Top 0.254: STM32F303.60 31.49,31.39 31.15,31.05 v31.15,30.48
  Bottom 0.254: v31.15,30.48 31.15,30.76 21.4,40.51 18.03,40.51 J2.2
ADC3_IN11  (via drill 0.3)
  Top 0.254: STM32F303.61 30.99,31.59 30.57,31.17 v30.57,30.48
  Bottom 0.254: v30.57,30.48 30.57,30.52 21.34,39.75 16.26,39.75 J2.1
ADC3_IN12  (via drill 0.3)
  Top 0.254: STM32F303.35 36.62,23.25 36.2,22.83 v35.69,22.83
  Bottom 0.254: J3.8 43.59,22.83 v35.69,22.83
ADC3_IN13  (via drill 0.3)
  Top 0.254: STM32F303.38 36,24.75 35.84,24.58 v35.69,24.58
  Bottom 0.254: J3.5 49.46,24.58 v35.69,24.58
ADC3_IN14  (via drill 0.3)
  Top 0.254: STM32F303.41 35.8,26.25 35.71,26.33 v35.69,26.33
  Bottom 0.254: v35.69,26.33 44.69,26.33 47.75,29.4 47.75,30.61 49.15,32 J3.2
ADC3_IN15  (via drill 0.3)
  Top 0.254: STM32F303.42 36,26.75 35.84,26.92 v35.69,26.92
  Bottom 0.254: v35.69,26.92 44.44,26.92 47.12,29.59 47.12,32.26 49.4,34.54 J3.1
ADC3_IN16  (via drill 0.3)
  Top 0.254: STM32F303.43 36.04,27.25 35.89,27.4 35.79,27.4 v35.69,27.5
  Bottom 0.254: v35.69,27.5 35.77,27.59 36.32,27.59 45.44,36.71 45.44,40.23 J2.15
ADC4_IN1  (via drill 0.3)
  Top 0.254: STM32F303.45 36.42,28.25 36,28.67 v35.69,28.67
  Bottom 0.254: v35.69,28.67 35.77,28.75 36.07,28.75 44.44,37.12 44.44,42.05 J2.13
ADC4_IN2  (via drill 0.3)
  Top 0.254: STM32F303.46 36.63,28.75 36.12,29.25 v35.69,29.25
  Bottom 0.254: v35.69,29.25 36.43,30 36.61,30 43.94,37.33 43.94,40 J2.12
ADC4_IN3  (via drill 0.3)
  Top 0.254: STM32F303.51 35.99,31.59 36.41,31.17 v36.41,30.48
  Bottom 0.254: J2.11 36.41,41.36 v36.41,30.48
ADC4_IN4  (via drill 0.3)
  Top 0.254: STM32F303.53 34.99,31.18 35.24,30.93 v35.24,30.48
  Bottom 0.254: J2.9 35.24,41.09 v35.24,30.48
ADC4_IN5  (via drill 0.3)
  Top 0.254: STM32F303.54 34.49,30.97 34.66,30.8 v34.66,30.48
  Bottom 0.254: v34.66,30.48 34.66,36.4 30.58,40.48 30.58,43.15 J2.8
ADC4_IN12  (via drill 0.3)
  Top 0.254: STM32F303.55 33.99,30.77 34.07,30.68 v34.07,30.48
  Bottom 0.254: v34.07,30.48 34.07,36.16 28.07,42.16 J2.7
ADC4_IN13  (via drill 0.3)
  Top 0.254: STM32F303.56 v33.49,30.48
  Bottom 0.254: v33.49,30.48 33.49,35.92 28.51,40.89 27.56,40.89 25.53,42.93 J2.6
BOOT0  (via drill 0.3)
  Top 0.254: R8.1 11.64,23.11 v18.8,23.11 | v23.88,21.84 23.78,21.75 STM32F303.94
  Bottom 0.254: v18.8,23.11 22.99,23.11 23.88,22.23 v23.88,21.84
GND  (via drill 0.3)
  Top 0.254: STM32F303.99 23.19,19.25 v24.26,20.32 | STM32F303.74 24.49,31.47 v24.26,31.24 | STM32F303.49 37.71,30.23 36.96,30.23 36.58,29.84 35.18,29.84 34.42,29.08 v34.42,27.94 | STM32F303.20 33.49,17.87 v34.04,18.41
  other vias: 37.34,32.38 33.66,39.37 29.59,36.45 47.37,25.65 47.37,22.99 46.1,21.59 44.83,20.32 29.46,9.14 31.62,8.64 37.34,39.37 43.05,39.37 36.7,8.64 41.78,8.51 44.83,8.38 46.86,8.38 20.83,29.08 20.83,24.64 20.83,22.1 18.8,22.35 23.11,33.27 24.26,27.94 24.26,25.4 24.26,22.86 26.8,20.32 29.34,20.32 31.88,20.32 34.42,20.32 34.42,22.86 34.42,25.4 26.8,25.4 26.8,22.86 26.8,27.94 29.34,27.94 29.34,25.4 29.34,22.86 31.88,22.86 31.88,25.4 31.88,27.94 29.34,30.48 26.8,30.48 41.78,12.95 37.59,16.26 7.87,20.7
  pour Top (isolate 0.305, rank 6): -1.02,48.77 -1.02,-0.51 72.77,-0.51 72.77,48.77
  pour Bottom (isolate 0.305, rank 6): -1.02,48.77 -1.02,-0.51 72.77,-0.51 72.77,48.77
N$1
  Top 0.254: TEST2.1 13.5,19.98 R5.1 R6.2
N$2
  Top 0.254: R7.2 31.96,14.35 arc-90 X1.1 arc90 30.69,11.81 C13.2
N$3
  Top 0.254: BOOT0.2 6.69,21.21 R8.2
N$4
  Top 0.406: U$3.V+ 7.71,12.83 R9.1
N$9
  Top 0.254: R4.2 R3.1 13.5,27.6 TEST1.1
N$10
  Top 0.406: J4.VBUS 4.75,34.07 F1.2
N$11
  Top 0.254: J4.D- 7.17,33.42 arc90 R1.2
N$12
  Top 0.254: J4.D+ 7.02,32.77 arc-90 R2.2 R10.2
N$13
  Bottom 0.203: R13.1 58.93,20.79 58.93,12.41 U5.1
N$14
  Bottom 0.203: R13.2 56.8,23.98 57.4,23.38 57.4,22.85 59.28,20.98 59.28,19.68 U6.1
N$15
  Bottom 0.203: U7.1 57.76,26.27 57.4,25.91 57.4,25.39 56.8,24.78 R13.3
N$16
  Bottom 0.203: R13.4 58.93,27.98 58.93,32.51 60.3,33.89 U8.1
NRST  (via drill 0.3)
  Top 0.254: U$3.!RST 11.33,8.41 RST.2 12.73,13.08 C9.1 v21.59,13.08 | v30.23,18.41 30.34,18.3 30.34,18.02 30.49,17.87 STM32F303.14
  Bottom 0.254: v21.59,13.08 25.4,13.08 30.23,17.91 v30.23,18.41
OUT1
  Bottom 0.203: R12.4 63.5,20.79 63.5,16.27 U5.3
  Bottom 0.254: R12.4 67.11,23.18 PHOTO.1
OUT2
  Bottom 0.203: R12.3 65.39,23.98 65.02,23.62 65.02,22.86 64.66,22.5 U6.3
  Bottom 0.254: R12.3 68.85,23.98 PHOTO.2
OUT3
  Bottom 0.203: R12.2 65.39,24.78 65.02,25.15 65.02,25.96 62.11,28.87 U7.3
  Bottom 0.254: R12.2 68.85,24.78 PHOTO.3
OUT4
  Bottom 0.203: R12.1 63.25,28.24 63.25,36.61 U8.3
  Bottom 0.254: R12.1 67.11,25.58 PHOTO.4
SWCLK  (via drill 0.3)
  Top 0.254: STM32F303.76 23.61,30.75 v23.75,30.61
  Bottom 0.254: v23.75,30.61 23.75,30.23 17.14,23.62 11.56,23.62 9.02,21.08 9.02,13.72 U$3.SWCLK
SWDIO  (via drill 0.3)
  Top 0.254: STM32F303.72 25.49,31.58 v25.27,31.37
  Bottom 0.254: v25.27,31.37 25.27,30.73 17.4,22.86 12.32,22.86 10.16,20.7 10.16,9.78 U$3.SWDIO
USBD_N
  Top 0.254: R1.1 arc90 10.31,33.21 17.34,33.21 arc90 17.78,33.66 arc-90 18.91,34.78 25.57,34.78 arc-90 26.49,33.87 STM32F303.70
USBD_P
  Top 0.254: STM32F303.71 | R2.1 arc-90 10.31,32.83 17.59,32.83 arc90 18.16,33.4 arc-90 19.04,34.27 25.44,34.27 arc-90 25.99,33.73 STM32F303.71
VDDA
  Top 0.254: STM32F303.21 STM32F303.22 34.49,15.06 C8.1 C7.1 34.42,12.03 B1.2
XTI
  Top 0.254: STM32F303.12 29.49,15.9 arc-90 28.58,14.99 arc90 27.86,14.27 X1.2 arc-90 27.22,11.81 C14.2
XTO
  Top 0.254: STM32F303.13 29.99,15.14 arc90 R7.1

### Text on the board
tPlace: 39 | 38 | 37 | 36 | 35 | 34 | 33 | 32 | 31 | 30 | 29 | 28 | 27 | 26 | 25 | ADC | 3 | 3 | 3 | 3 | 3 | 4 | 4 | 4 | 4 | 3 | 4 | 4 | 4 | 3 | 3 | IN | 11 | 10 | 9 | 8 | 7 | 13 | 12 | 5 | 4 | 5 | 3 | 2 | 1 | 3 | 16 | STM32F3 ADC Test V2 / Aug 30, 2019 | 3 | 15 | 24 | 3 | 14 | 23 | 3 | 2 | 22 | GND | 3 | 6 | 21 | 3 | 13 | 20 | 2 | 12 | 19 | 3 | 1 | 18 | 3 | 12 | 17 | VCC | 2 | 11 | 16 | ADC | IN | ADC | 1 | 1 | 1 | 1 | 1 | 1 | 1 | 1 | 1 | 1 | 2 | 2 | 2 | 2 | 2 | IN | 6 | 7 | 8 | 9 | 10 | 1 | 2 | 2 | 3 | 4 | 5 | 1 | 2 | 2 | 3 | 4 | 5 | 1 | 2 | 3 | 4 | 5 | 6 | 7 | 8 | 9 | 10 | 11 | 12 | 13 | 14 | 15